# EAGLE schematic GBASP USB-C (EAGLE 6.2)
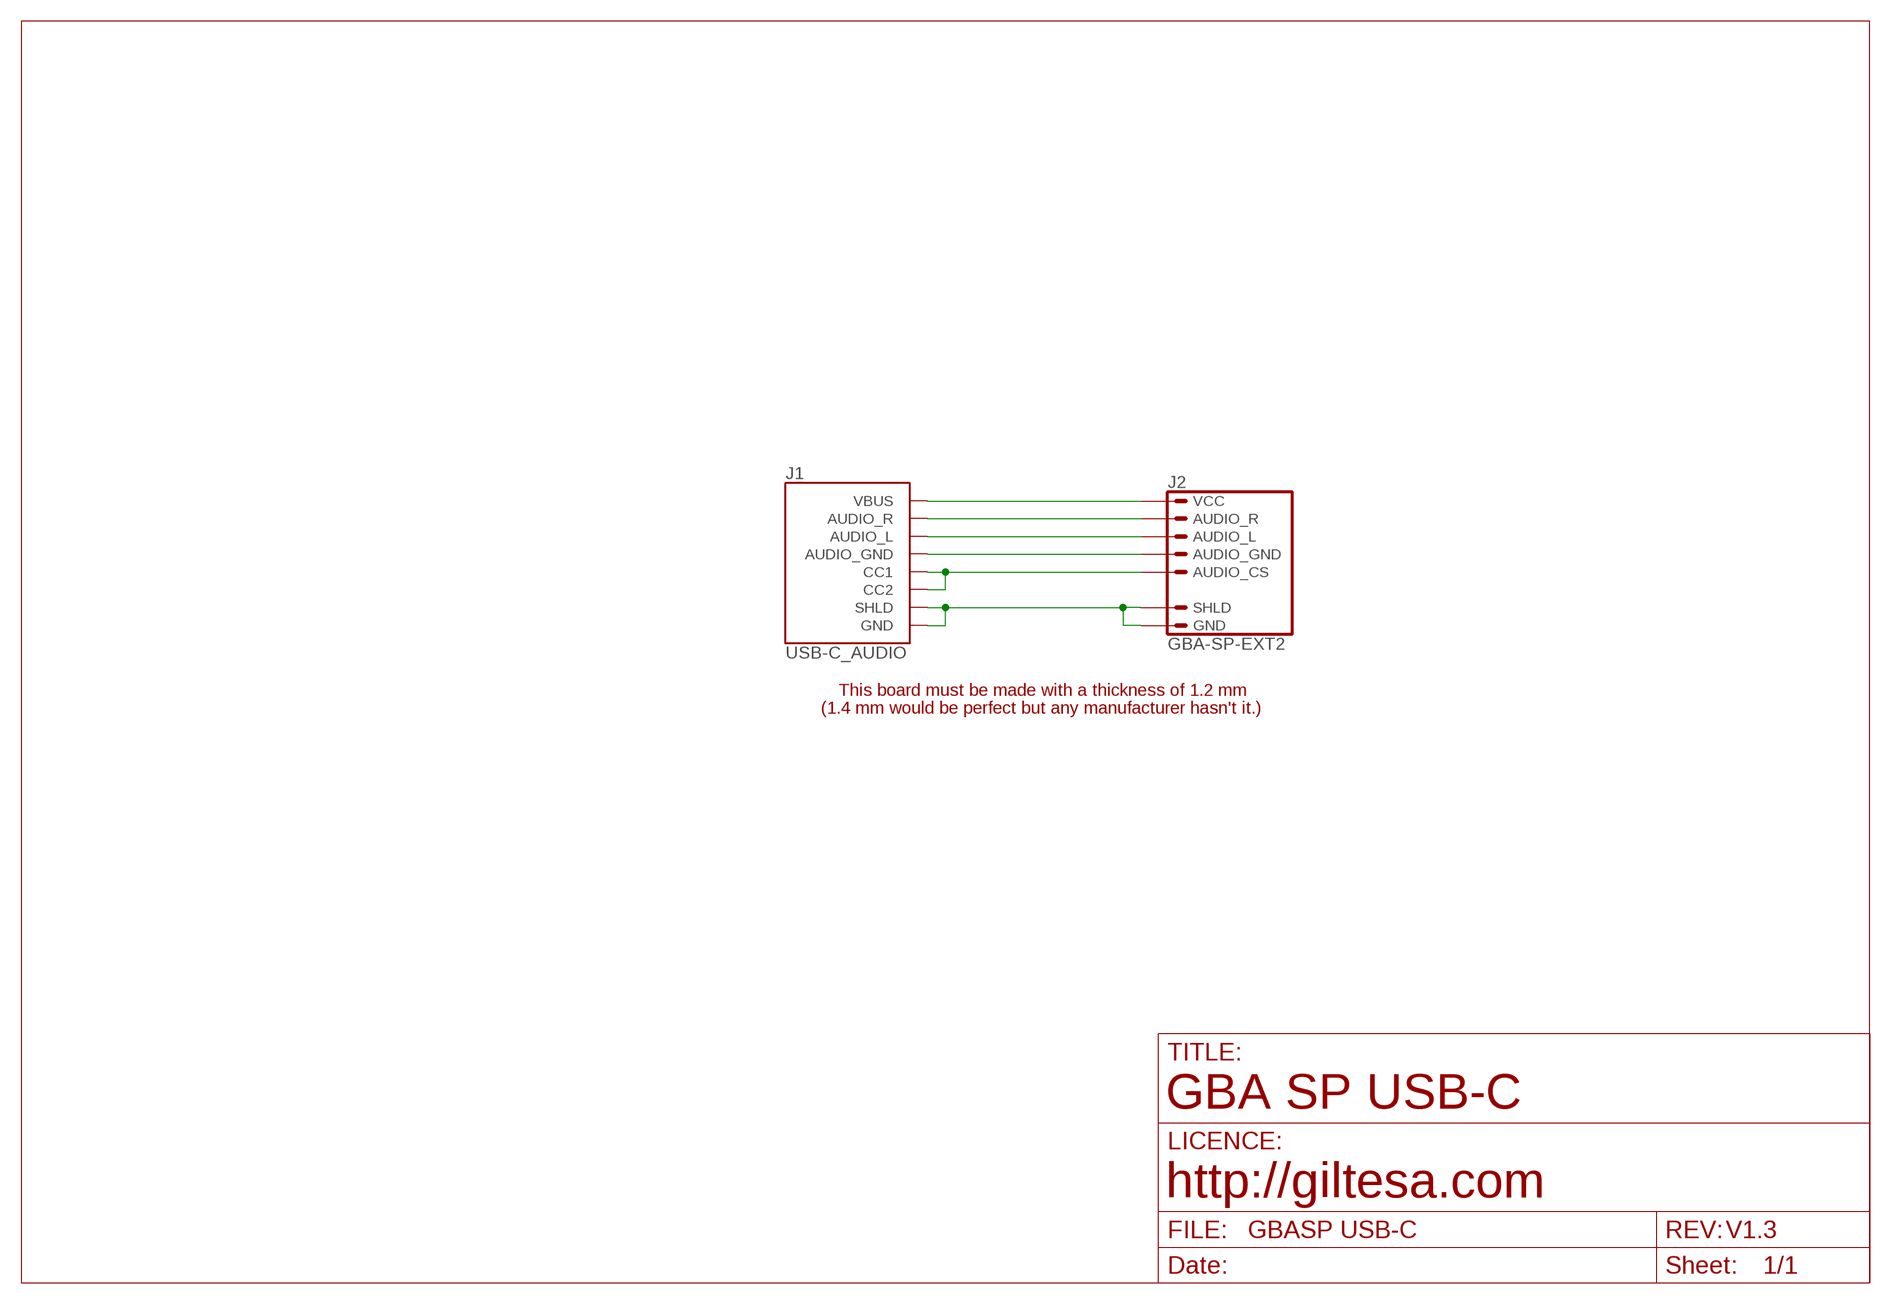
[diagram p0: schematic, sheet 1]

## Parts
J1  USB-C_AUDIO  USB-C_POWER_AUDIOGBASP  [USB-C_16P_3SHLD]
J2  GBA-SP-EXT2  [GBA-SP-EXT2]

## Nets
AUDIO_GND: J1.A8(AUDIO_GND) J1.B8(AUDIO_GND) J2.AUDIO_GND
AUDIO_L: J1.A7(AUDIO_L) J1.B7(AUDIO_L) J2.AUDIO_L
AUDIO_R: J1.A6(AUDIO_R) J1.B6(AUDIO_R) J2.AUDIO_R
CC2: J1.A5(CC1) J1.B5(CC2) J2.AUDIO_CS
GND: J1.GND J1.GND2(GND) J1.SHLD1(SHLD) J1.SHLD1_2(SHLD) J1.SHLD3(SHLD) J1.SHLD3_2(SHLD) J1.SHLD4(SHLD) J1.SHLD4_2(SHLD) J1.SHLD5(SHLD) J1.SHLD5_2(SHLD) J1.SHLD6(SHLD) J1.SHLD6_2(SHLD) J1.SHLD7(SHLD) J1.SHLD7_2(SHLD) J1.SHLD8(SHLD) J1.SHLD8_2(SHLD) J2.GND J2.SHLD1(SHLD) J2.SHLD2(SHLD) J2.SHLD3(SHLD) J2.SHLD4(SHLD)
VCC: J1.VBUS1(VBUS) J1.VBUS2(VBUS) J2.VCC

## Notes on the sheet
- This board must be made with a thickness of 1.2 mm
- (1.4 mm would be perfect but any manufacturer hasn't it.)
- GBA SP USB-C
- http://giltesa.com
- V1.3

## Library data of the parts
J1 = ,giltesa:USB-C_POWER_AUDIO
J2 = ,giltesa:GBA-SP-EXT2

## Net classes
1 power: width 0.61 mm, drill 0.406 mm, clearance 0.203 mm
2 gnd: width 0.305 mm, drill 0.406 mm, clearance 0.203 mm
3 power usb: width 0.508 mm, drill 0.406 mm, clearance 0.203 mm